# EasyEDA Pro project ProDoc_PCB1_2024-06-28.epro

# Board PCB1
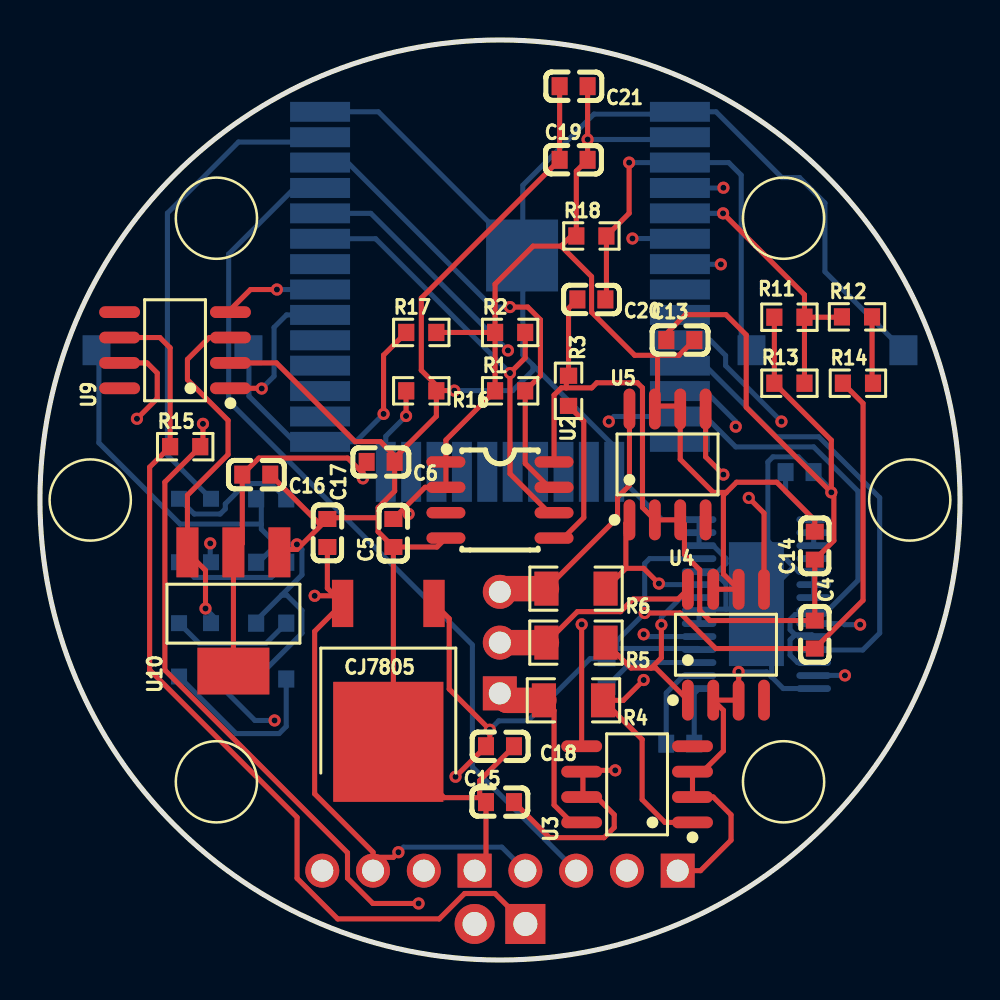
[diagram p0: board, top side]
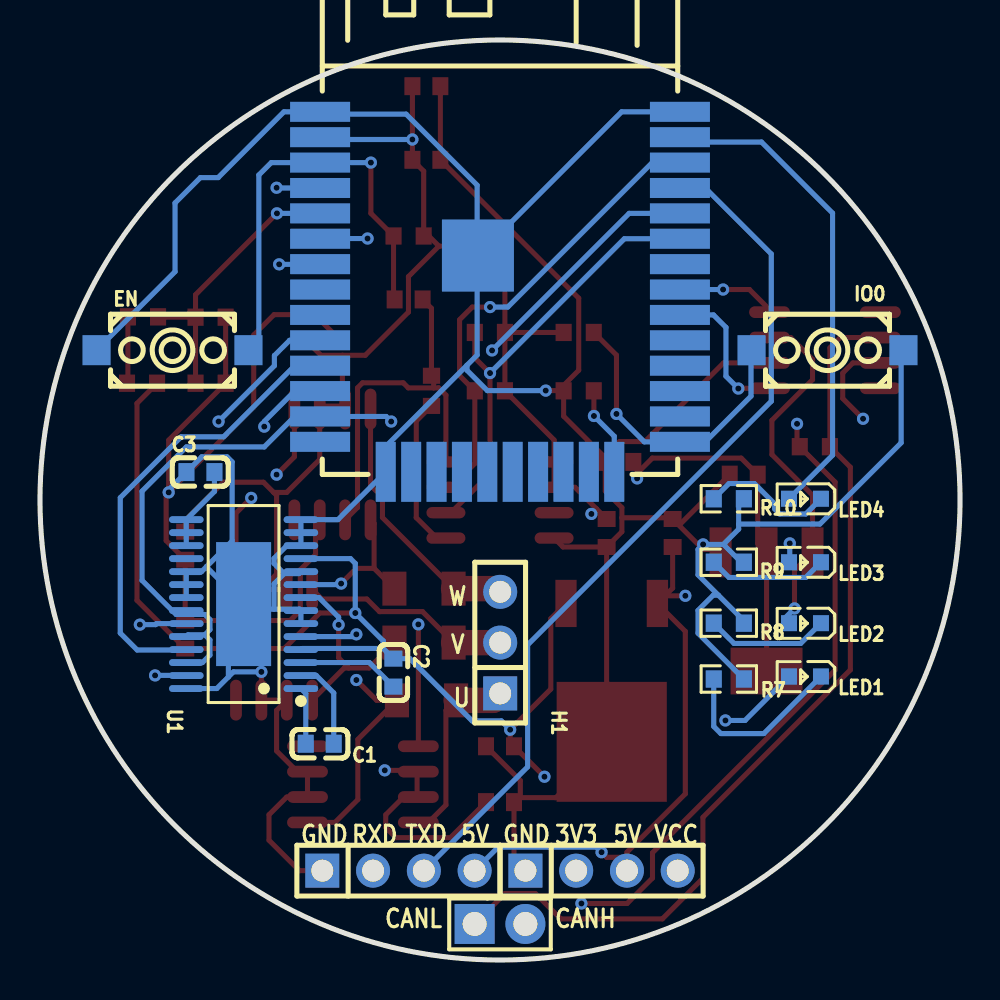
[diagram p1: board, bottom side, seen from below]

Outline 46.02 x 46.02 mm; copper layers: Top Layer, Inner1, Inner2, Bottom Layer. Coordinates in mm from the lower left corner of the outline.
Outline path: circle c23.01,23.01 r23.01
Stack: Top Layer 0.035mm 外层铜厚1oz / Dielectric1 0.2104mm 7628 RC49% 8.6mil / Inner1 0.0152mm 内层铜厚 / Dielectric2 1.065mm 1.1mm H/HOZ Copper / Inner2 0.0152mm 内层铜厚 / Dielectric3 0.2104mm 7628 RC49% 8.6mil / Bottom Layer 0.035mm 外层铜厚1oz

## Design rules (mm)
template: JLCPCB Capability(Two Layers Board)
spacing copperThickness1oz (default): track to track 0.102, other pairs 0.152 to 0.3
spacing copperThickness2oz: track to track 0.203, other pairs 0.152 to 0.3
track width copperThickness1oz (default): min 0.127, default 0.254, max 2.54
track width copperThickness2oz: min 0.203, default 0.254, max 2.54
differential pair differentialPair (default): width min 0.127, default 0.254, max 2.54; gap min 0.152, default 0.152
via viaSize (default): diameter min 0.5, default 0.61, max 10; hole min 0.3, default 0.305, max 6.3

## Placement (name value [footprint] x y rotation side)
C1  10nF  [C0603]  32.03 10.82 0 bottom
C2  0.1uF  [C0603]  28.35 14.38 270 bottom
C3  470nF  [C0603]  38 24.41 180 bottom
C4  0.1uF  [C0603]  38.76 16.28 270 top
C5  0.1uF  [C0603]  17.68 21.36 90 top
C6  1uF  [C0603]  17.04 24.92 180 top
C13  100nF  [C0603]  32.03 31.01 0 top
C14  100nF  [C0603]  38.76 20.73 90 top
C15  100nF  [C0603]  23.01 7.9 0 top
C16  100nF  [C0603]  10.82 24.28 180 top
C17  1uF  [C0603]  14.38 21.36 270 top
C18  1uF  [C0603]  23.01 10.69 180 top
C19  100nF  [C0603]  26.7 40.03 0 top
C20  100nF  [C0603]  27.58 33.05 180 top
C21  1uF  [C0603]  26.7 43.71 180 top
CJ7805  CJ7805 3%  [TO-252-2_L6.6-W6.1-P4.58-LS10.1-BR-CW]  17.42 14.38 90 top
EN  K2-1107ST-A4DW-06  [KEY-SMD_L6.2-W3.6-LS8.0]  39.4 30.51 180 bottom
H1  PZ254V-11-03P  [HDR-TH_3P-P2.54-V-M]  23 15.88 90 bottom
H2  PZ254V-11-04P  [HDR-TH_4P-P2.54-V-M]  17.93 4.47 180 bottom
H3  PZ254V-11-04P  [HDR-TH_4P-P2.54-V-M]  28.09 4.47 180 bottom
H4  PZ254V-11-02P  [HDR-TH_2P-P2.54-V-M]  23.01 1.8 180 bottom
IO0  K2-1107ST-A4DW-06  [KEY-SMD_L6.2-W3.6-LS8.0]  6.63 30.51 0 bottom
LED1  KT-0603R  [LED0603-RD]  7.76 14.18 0 bottom
LED2  KT-0603R  [LED0603-RD]  7.76 16.85 0 bottom
LED3  KT-0603R  [LED0603-RD]  7.76 19.9 0 bottom
LED4  KT-0603R  [LED0603-RD]  7.76 23.07 0 bottom
R1  10kΩ  [R0603]  23.52 28.47 0 top
R2  10kΩ  [R0603]  23.52 31.39 0 top
R3  1kΩ  [R0603]  26.44 28.47 270 top
R4  10mΩ  [R1206]  26.69 12.99 180 top
R5  10mΩ  [R1206]  26.81 15.88 180 top
R6  10mΩ  [R1206]  26.82 18.58 180 top
R7  1kΩ  [R0603]  11.57 14.06 0 bottom
R8  1kΩ  [R0603]  11.57 16.85 0 bottom
R9  1kΩ  [R0603]  11.57 19.9 0 bottom
R10  1kΩ  [R0603]  11.57 23.07 0 bottom
R11  1kΩ  [R0603]  37.49 32.16 0 top
R12  10kΩ  [R0603]  40.87 32.17 0 top
R13  1kΩ  [R0603]  37.49 28.85 0 top
R14  10kΩ  [R0603]  40.92 28.85 0 top
R15  120Ω  [R0603]  7.26 25.68 0 top
R16  1kΩ  [R0603]  19.08 28.47 180 top
R17  10kΩ  [R0603]  19.08 31.39 0 top
R18  10kΩ  [R0603]  27.58 36.22 0 top
U1  DRV8313PWPR  [HTSSOP-28_L9.8-W4.5-P0.65-LS6.6-BL-EP]  35.84 17.81 90 bottom
U2  AS5600-ASOM  [SOIC-8_L5.0-W4.0-P1.27-LS6.0-BL]  23.01 23.01 270 top
U3  INA240A2DR  [SOIC-8_L4.9-W3.9-P1.27-LS6.0-BL]  29.87 8.79 90 top
U4  INA240A2DR  [SOIC-8_L4.9-W3.9-P1.27-LS6.0-BL]  34.32 15.77 0 top
U5  INA240A2DR  [SOIC-8_L4.9-W3.9-P1.27-LS6.0-BL]  31.39 24.79 0 top
U6  2.4GHz  [WIRELM-SMD_ESP32-S]  23.01 33.43 180 bottom
U9  TJA1051T/3/1J  [SOIC-8_L4.9-W3.9-P1.27-LS6.0-BL]  6.76 30.51 90 top
U10  AMS1117-3.3  [SOT-223-3_L6.5-W3.4-P2.30-LS7.0-BR]  9.68 17.42 90 top

## Footprints (pads in the part's own frame, mm; a bottom-side part is the same pattern mirrored in y, then rotated)
C0603
  rect 0.8x0.9 smd: 1(-0.7,0) 2(0.7,0)
HDR-TH_2P-P2.54-V-M
  rect 2x2 hole 1.2: 1(-1.27,0)
  round 2 hole 1.2: 2(1.27,0)
HDR-TH_3P-P2.54-V-M
  rect 1.7x1.7 hole 1.1: 1(-2.54,0)
  round 1.7 hole 1.1: 2(0,0) 3(2.54,0)
HDR-TH_4P-P2.54-V-M
  rect 1.7x1.7 hole 1.1: 1(-3.81,0)
  round 1.7 hole 1.1: 2(-1.27,0) 3(1.27,0) 4(3.81,0)
HTSSOP-28_L9.8-W4.5-P0.65-LS6.6-BL-EP
  oval 0.343x1.732 smd: 1(-4.225,-2.866) 2(-3.575,-2.866) 3(-2.925,-2.866) 4(-2.275,-2.866) 5(-1.625,-2.866) 6(-0.975,-2.866) 7(-0.325,-2.866) 8(0.325,-2.866) 9(0.975,-2.866) 10(1.625,-2.866) 11(2.275,-2.866) 12(2.925,-2.866) 13(3.575,-2.866) 14(4.225,-2.866) 15(4.225,2.866) 16(3.575,2.866) 17(2.925,2.866) 18(2.275,2.866) 19(1.625,2.866) 20(0.975,2.866) 21(0.325,2.866) 22(-0.325,2.866) 23(-0.975,2.866) 24(-1.625,2.866) 25(-2.275,2.866) 26(-2.925,2.866) 27(-3.575,2.866) 28(-4.225,2.866)
  rect 6.2x2.75 smd: 29(0,0)
KEY-SMD_L6.2-W3.6-LS8.0
  rect 1.4x1.5 smd: 1(-3.8,0) 2(3.8,0)
LED0603-RD
  rect 0.8x0.8 smd: 1(-0.799,0) 2(0.799,0)
R0603
  rect 0.806x0.864 smd: 1(-0.753,0) 2(0.753,0)
R1206
  rect 1.208x1.701 smd: 1(-1.479,0) 2(1.479,0)
SOIC-8_L4.9-W3.9-P1.27-LS6.0-BL
  oval 0.588x2.045 smd: 1(-1.905,-2.772) 2(-0.635,-2.772) 3(0.635,-2.772) 4(1.905,-2.772) 5(1.905,2.772) 6(0.635,2.772) 7(-0.635,2.772) 8(-1.905,2.772)
SOIC-8_L5.0-W4.0-P1.27-LS6.0-BL
  oval 0.569x1.95 smd: 1(-1.905,-2.705) 2(-0.635,-2.705) 3(0.635,-2.705) 4(1.905,-2.705) 5(1.905,2.705) 6(0.635,2.705) 7(-0.635,2.705) 8(-1.905,2.705)
SOT-223-3_L6.5-W3.4-P2.30-LS7.0-BR
  rect 2.5x1.1 smd: 1(2.97,-2.3) 2(2.97,0) 3(2.97,2.3)
  rect 2.34x3.6 smd: 4(-2.97,0)
TO-252-2_L6.6-W6.1-P4.58-LS10.1-BR-CW
  rect 2.364x1.064 smd: 1(3.462,-2.286) 3(3.462,2.286)
  rect 6.004x5.512 smd: 2(-3.462,0)
WIRELM-SMD_ESP32-S
  rect 3x1 smd: 1(-9,9.005) 2(-9,7.735) 3(-9,6.465) 4(-9,5.195) 5(-9,3.925) 6(-9,2.655) 7(-9,1.385) 8(-9,0.115) 9(-9,-1.155) 10(-9,-2.425) 11(-9,-3.695) 12(-9,-4.965) 13(-9,-6.235) 14(-9,-7.505) 25(9,-7.505) 26(9,-6.235) 27(9,-4.965) 28(9,-3.695) 29(9,-2.425) 30(9,-1.155) 31(9,0.115) 32(9,1.385) 33(9,2.655) 34(9,3.925) 35(9,5.195) 36(9,6.465) 37(9,7.735) 38(9,9.005)
  rect 1x3 smd: 15(-5.715,-9.005) 16(-4.445,-9.005) 17(-3.175,-9.005) 18(-1.905,-9.005) 19(-0.635,-9.005) 20(0.635,-9.005) 21(1.905,-9.005) 22(3.175,-9.005) 23(4.445,-9.005) 24(5.715,-9.005)
  rect 3.6x3.6 smd: 39(-1.105,1.815)

## Nets
3V3: C5.2 C6.2 C13.2 C14.2 C15.2 C16.2 C19.2 C21.1 H2.2 R1.1 R2.1 R17.2 R18.1 U2.1 U2.2 U3.6 U3.7 U4.6 U4.7 U5.6 U5.7 U6.2 U10.2 U10.4
+5V: C17.2 CJ7805.3 H2.3 H3.4 LED2.2 U9.3 U10.3
GND: C3.1 C4.1 C5.1 C6.1 C13.1 C14.1 C15.1 C16.1 C17.1 C18.1 C19.1 C20.2 C21.2 CJ7805.2 EN.1 H2.1 H3.1 IO0.1 R3.1 R7.1 R8.1 R9.1 R10.1 R11.1 R13.1 R16.1 U1.6 U1.7 U1.10 U1.12 U1.13 U1.14 U1.19 U1.20 U1.21 U1.28 U1.29 U2.4 U2.8 U3.2 U3.3 U4.2 U4.3 U5.2 U5.3 U6.1 U6.15 U6.38 U6.39 U9.2 U10.1
VCC: C2.1 C4.2 C18.2 CJ7805.1 H2.4 LED1.2 R14.1 U1.4 U1.11
VCC_ADC: R11.2 R12.1 R13.2 U6.5
CAN_RXD: U6.31 U9.4
CAN_TXD: U6.30 U9.1
CANH: H4.2 R15.2 U9.7
CANL: H4.1 R15.1 U9.6
EN: LED3.2 U1.22 U1.24 U1.26 U6.13
ESP_RXD: H3.2 U6.34
ESP_TXD: H3.3 U6.35
I_U: U3.5 U6.6
I_V: U4.5 U6.7
I_W: U5.5 U6.4
IO-LED: LED4.2 U6.37
OUT_U: R4.1 U1.5 U3.1
OUT_V: R5.1 U1.8 U4.1
OUT_W: R6.1 U1.9 U5.1
PWM_U: U1.27 U6.10
PWM_V: U1.25 U6.11
PWM_W: U1.23 U6.12
SCL: R1.2 U2.7 U6.36
SDA: R2.2 U2.6 U6.33
U: H1.1 R4.2 U3.8
V: H1.2 R5.2 U4.8
W: H1.3 R6.2 U5.8
$1N347: C3.2 U1.15 U1.16 U1.17
$1N350: C1.2 U1.1
$1N351: C1.1 U1.2
$1N352: C2.2 U1.3
$1N750: R3.2 U2.5
$1N6376: LED1.1 R7.2
$1N6414: LED2.1 R8.2
$1N9932: R12.2 R14.2
$1N9943: IO0.2 R17.1 U6.25
$1N9983: R16.2 U6.24
$1N10250: C20.1 EN.2 R18.2 U6.3
$1N11040: LED3.1 R9.2
$1N11082: LED4.1 R10.2

Pads without a net: U1 18; U2 3; U3 4; U4 4; U5 4; U6 8 9 14 16 17 18 19 20 21 22 23 26 27 28 29 32; U9 5 8

## Via types
v1: diameter 0.61, hole 0.305, Top Layer to Bottom Layer, 43 vias

## Routing (per net, layer and track width the routed paths; a pad name or vN(x,y) marks a point on that pad's centre or on a via; arc(x,y) is an arc through that point)
3V3: length 128.3
  Top Layer w0.254: 27.16,9.36 U3.6 ; 27.16,9.36 27.33,9.36 27.46,9.49 v1(28.78,9.49) ; 27.16,9.36 27.16,8.15 ; 27.4,43.71 v1(27.4,41.05) 27.4,40.03 26.83,39.47 R18.1 26.58,36.22 26.07,35.71 ; 18.19,22.57 v1(18.44,22.32) ; 18.19,22.57 C5.2 ; 18.19,22.57 19.26,23.65 U2.2 U2.1 20.31,26.01 R1.1 R2.1 ; U10.4 U10.2 10.12,20.84 C16.2 10.95,25.11 15.39,25.11 16.15,24.35 ; 30.89,30.25 30.89,27.71 ; 30.89,30.25 29.75,30.25 27.59,32.41 27.59,34.19 26.07,35.71 ; 30.89,30.25 31.97,30.25 C13.2 ; 30.89,27.71 31.88,27.71 U5.6 32.03,25.04 33.68,23.39 34.34,23.39 ; 30.89,27.71 30.89,27.7 U5.7 ; 27.16,8.15 U3.7 ; 27.16,8.15 27.84,8.15 28.73,7.26 28.73,6.63 28.22,6.12 25.49,6.12 C15.2 ; 26.07,35.71 24.66,35.71 22.77,33.82 R2.1 ; U4.7 U4.6 34.19,19.31 34.19,23.24 34.34,23.39 ; R2.1 R17.2 ; C14.2 38.76,22 36.86,23.9 34.84,23.9 34.34,23.39 ; 16.15,24.35 16.15,24.73 C6.2 ; 16.15,24.35 v1(16.15,24.09)
  Inner1 w0.254: v1(28.78,9.49) 28.78,10.64 27.08,12.34 ; 27.08,12.34 H2.2 ; 27.08,12.34 27.08,13.43 23.27,17.24 22.5,17.24 18.44,21.3 v1(18.44,22.32) 17.93,22.32 v1(16.15,24.09)
  Bottom Layer w0.254: v1(27.4,41.05) 31.9,41.05 U6.2
+5V: length 51.4
  Top Layer w0.254: 14.76,18.22 CJ7805.3 13.74,16.44 13.74,8.31 16.66,5.39 16.66,5.14 ; 14.76,18.22 14.38,18.6 C17.2 ; 14.76,18.22 v1(13.74,18.22) ; 16.66,5.14 H2.3 ; 16.66,5.14 17.68,5.14 v1(17.93,5.39) ; 9.4,31.14 8.47,31.14 7.38,30.05 7.38,29.03 9.41,27 9.41,25.28 7.38,23.25 U10.3 8.28,19.49 v1(8.28,17.58)
  Inner1 w0.254: v1(8.28,17.58) 13.11,17.58 v1(13.74,18.22)
  Bottom Layer w0.254: v1(8.28,17.58) 8.79,17.08 LED2.2 ; v1(17.93,5.39) 18.19,5.65 23.11,5.65 H3.4
GND: length 283.6
  Top Layer w0.254: 22,8.12 22.09,8.12 C15.1 22.31,5.04 H2.1 ; 22,8.12 22,8.98 C18.1 ; 22,8.12 20.22,8.12 CJ7805.2 17.68,11.17 C5.1 ; U10.1 12.12,20.54 12.85,20.54 ; 26.33,28.62 26.08,28.62 25.72,28.26 U2.8 ; 26.33,28.62 26.33,29.12 R3.1 26.44,32.6 C20.2 ; 26.33,28.62 27.6,28.62 27.85,28.88 29.89,28.88 30.14,28.62 30.14,22.64 U5.2 U5.3 32.24,21.81 32.24,20.28 33,19.52 33,17.49 33.51,16.98 38.76,16.98 C14.1 39.71,20.98 39.71,23.27 v1(39.59,23.39) ; 17.8,25.17 17.03,25.93 15.76,25.93 11.83,29.87 9.4,29.87 ; 17.8,25.17 17.8,24.97 C6.1 17.74,23.46 16.92,22.63 16.92,22.12 ; 17.8,25.17 19.83,27.2 R16.1 19.84,28.49 20.09,28.49 ; v1(39.59,23.39) 39.59,26 R13.1 R11.1 ; v1(39.59,23.39) 35.33,27.65 35.33,31.27 34.32,32.28 32.28,32.28 31.33,31.33 C13.1 ; v1(20.73,28.49) 20.09,28.49 ; 20.09,28.49 19.08,29.5 19.08,33.11 C19.1 C21.2 ; C5.1 19.86,20.66 U2.4 ; C5.1 16.92,21.42 16.92,22.12 ; v1(34.95,14.41) U4.3 U4.2 34.19,12.49 34.19,10.46 33.15,9.42 U3.3 U3.2 33.68,8.15 34.57,7.26 34.57,5.99 33.05,4.47 H3.1 ; 14.12,21.81 C17.1 14.44,22.12 16.92,22.12 ; 14.12,21.81 14,21.81 C16.1 ; 14.12,21.81 12.85,20.54 ; 12.85,20.54 v1(12.85,20.79)
  Bottom Layer w0.254: 34.32,17.55 33.04,17.55 U1.7 U1.6 ; 34.32,17.55 34.32,18.82 33.81,19.33 ; 34.32,17.55 35.59,17.55 ; 11.84,20.79 10.94,19.9 R9.1 ; 11.84,20.79 11.07,21.55 11.07,21.81 ; 11.84,20.79 v1(12.85,20.79) 13.11,20.54 13.11,19.27 12.09,18.25 ; v1(34.95,14.41) 36.35,14.41 36.6,14.16 ; 36.6,14.16 37.18,13.58 U1.28 ; 36.6,14.16 36.6,15.27 35.59,16.28 35.59,17.55 ; 11.07,21.81 11.07,22.81 R10.1 ; 11.07,21.81 7.01,21.81 2.95,25.87 2.95,30.39 IO0.1 ; 24.66,29.76 24.16,30.26 24.16,35.2 ; 24.66,29.76 24.66,29.5 23.65,28.49 v1(20.73,28.49) ; 24.66,29.76 28.73,25.69 U6.15 31.12,22.03 U1.14 U1.13 U1.12 33.68,20.73 34.32,20.09 34.32,19.84 33.81,19.33 ; 33.81,19.33 33.07,19.33 U1.10 ; 12.09,18.25 12.34,18.25 13.11,17.49 13.11,16.35 R7.1 ; 12.09,18.25 10.81,16.97 R8.1 ; v1(39.59,23.39) 39.59,23.52 C3.1 37.94,25.17 36.67,25.17 36.41,24.92 36.41,20.96 37.68,19.69 ; 43.19,30.51 39.27,34.43 39.27,37.87 38,39.14 37.11,39.14 33.82,42.43 U6.1 31.9,42.32 27.71,42.32 24.16,38.76 24.16,35.2 ; 37.68,19.69 37.94,19.43 U1.19 U1.20 U1.21 ; 37.68,19.69 37.68,19.65 U1.29 35.59,17.55 ; U6.38 16.93,42.43 U6.39 24.16,35.2
VCC: length 75.2
  Top Layer w0.254: v1(30.25,17.36) 32.03,17.36 33.81,15.58 C4.2 41.17,17.99 41.17,27.85 R14.1 ; v1(20.79,9.17) C18.2 22.5,10.89 v1(22.5,11.52) 20.47,13.55 20.47,17.08 CJ7805.1
  Inner1 w0.254: 16.22,5.61 16.22,7.5 v1(11.74,11.98) ; 16.22,5.61 15.27,5.61 H2.4 ; 16.22,5.61 17.23,5.61 v1(20.79,9.17)
  Bottom Layer w0.254: U1.4 32.92,15.58 28.85,15.58 ; 28.85,15.58 28.85,15.96 v1(30.25,17.36) 30.25,19.84 30.49,20.08 U1.11 ; 28.85,15.58 C2.1 27.52,15.08 24.41,11.96 22.95,11.96 v1(22.5,11.52) ; v1(11.74,11.98) 10.75,11.98 LED1.2
VCC_ADC: length 14.3
  Top Layer w0.254: R11.2 40.1,32.16 R12.1 ; R11.2 38.24,33.28 v1(34.17,37.35) ; R11.2 38.24,28.98 38.12,28.85
  Bottom Layer w0.254: v1(34.17,37.35) U6.5
CAN_RXD: length 5.1
  Top Layer w0.254: v1(11.85,33.54) 10.53,33.54 9.4,32.41
  Bottom Layer w0.254: U6.31 v1(11.85,33.54)
CAN_TXD: length 7.9
  Top Layer w0.254: v1(11.09,28.59) 11.08,28.6 9.05,28.6
  Bottom Layer w0.254: v1(11.09,28.59) 11.71,29.21 11.71,31.65 12.33,32.27 U6.30
CANH: length 42.8
  Top Layer w0.254: v1(18.94,2.83) 16.65,2.83 15.38,4.1 15.38,5.37 6.25,14.5 6.25,23.91 R15.2 8.15,25.81 v1(8.15,26.82) ; v1(4.85,27.08) 5.87,28.09 5.87,29.36 5.36,29.87 U9.7
  Inner1 w0.254: v1(4.85,27.08) 7.9,27.08 v1(8.15,26.82) ; H4.2 20.72,2.83 v1(18.94,2.83)
CANL: length 46.3
  Top Layer w0.254: 3.86,31.14 5.99,31.14 6.51,30.62 R15.1 5.49,24.65 5.49,14.51 12.86,7.14 12.86,4.09 14.89,2.06 19.97,2.06 21.24,3.33 22.76,3.33 H4.1
EN: length 52.1
  Inner2 w0.254: v1(28.46,26.94) 21.23,19.71 10.31,19.71 9.18,20.84 v1(8.52,20.84)
  Bottom Layer w0.254: LED3.2 8.52,19.94 v1(8.52,20.84) ; U1.26 37.9,14.88 37.52,15.25 37.52,16.02 37.78,16.27 ; 39.41,17.48 39.21,17.29 37.78,17.29 37.52,17.03 37.52,16.52 37.78,16.27 ; 39.41,17.48 U1.22 ; 39.41,17.48 40.92,18.99 40.92,23.45 38.71,25.67 34.81,25.67 33.28,27.19 U6.13 28.71,27.19 v1(28.46,26.94) ; 37.78,16.27 38.62,16.27 U1.24
ESP_RXD: length 40.7
  Inner1 w0.254: v1(23.41,30.49) 29.36,24.54 H3.2
  Bottom Layer w0.254: U6.34 16.55,37.35 v1(23.41,30.49)
ESP_TXD: length 44
  Bottom Layer w0.254: H3.3 21.63,9.66 21.63,15.76 9.44,27.95 9.44,35.32 12.74,38.62 14.01,38.62
I_U: length 28.8
  Top Layer w0.254: U3.5 v1(27.1,16.79)
  Inner2 w0.254: v1(27.1,16.79) 29.64,19.33 v1(29.64,36.09)
  Bottom Layer w0.254: v1(29.64,36.09) 30.73,36.09 30.74,36.08 U6.6
I_V: length 19.2
  Top Layer w0.254: v1(35.46,23.12) 36.22,22.36 U4.5
  Inner1 w0.254: v1(35.46,23.12) 35.46,33.4 v1(34.06,34.8)
  Bottom Layer w0.254: U6.7 32.02,34.8 v1(34.06,34.8)
I_W: length 20.9
  Top Layer w0.254: v1(34.19,24.28) 33.3,25.17 U5.5
  Inner2 w0.254: v1(34.19,24.28) 34.19,32.66 35.08,33.55 35.08,37.74 v1(34.19,38.63)
  Bottom Layer w0.254: v1(34.19,38.63) 34.18,38.62 32.01,38.62
IO-LED: length 24.4
  Bottom Layer w0.254: LED4.2 6.38,25.25 6.38,37.36 9.93,40.92 13.77,40.92 U6.37
OUT_U: length 16.3
  Top Layer w0.254: v1(30.2,14.01) 29.18,12.99 R4.1 30.12,11.03 30.12,8.03 31.27,6.88 U3.1
  Inner2 w0.254: v1(30.2,14.01) v1(30.2,16.29)
  Bottom Layer w0.254: v1(30.2,16.29) 30.31,16.18 U1.5
OUT_V: length 10.4
  Top Layer w0.254: 30.58,14.61 29.56,14.61 R5.1 ; 30.58,14.61 31.09,15.12 v1(31.09,16.77) ; 30.58,14.61 30.8,14.61 U4.1
  Bottom Layer w0.254: U1.8 32.07,18.13 31.09,17.15 v1(31.09,16.77)
OUT_W: length 7.9
  Top Layer w0.254: v1(30.96,18.83) 30.2,19.59 29.31,19.59 ; 29.31,19.59 R6.1 ; 29.31,19.59 29.31,21.84 U5.1
  Bottom Layer w0.254: U1.9 31.01,18.78 v1(30.96,18.83)
PWM_U: length 22.6
  Inner1 w0.254: v1(37.09,26.94) 37.09,17.41 v1(40.27,14.24)
  Bottom Layer w0.254: v1(40.27,14.24) 38.71,14.24 U1.27 ; v1(37.09,26.94) 34.3,29.73 34.3,30.24 33.54,31 U6.10
PWM_V: length 23.2
  Bottom Layer w0.254: U6.11 33.28,29.73 36.84,26.18 38.96,26.18 42.01,23.13 42.01,16.35 41.16,15.51 38.73,15.51 U1.25
PWM_W: length 18.5
  Inner2 w0.254: v1(34.81,26.68) 34.81,26.08 41.03,19.85 v1(41.03,16.78)
  Bottom Layer w0.254: v1(34.81,26.68) 34.81,26.94 33.28,28.46 U6.12 ; U1.23 40.19,16.83 40.25,16.78 v1(41.03,16.78)
SCL: length 23.8
  Top Layer w0.254: U2.7 25.64,23.57 25.54,23.57 24.27,24.84 R1.2 25.04,29.24 25.04,32.03 24.4,32.66 v1(23.51,32.66)
  Bottom Layer w0.254: U6.36 14.02,39.9 15.38,39.9 22.62,32.66 v1(23.51,32.66)
SDA: length 22.7
  Top Layer w0.254: R2.2 24.27,30.12 v1(23.51,29.36) 23.51,24.33 25.46,22.38 U2.6
  Bottom Layer w0.254: U6.33 16.79,36.08 v1(23.51,29.36)
U: length 9.5
  Top Layer w0.254: U3.8 26.59,6.88 25.72,7.76 25.72,12.48 R4.2
  Top Layer w1.27: H1.1 23.35,12.99 R4.2
V: length 10.5
  Top Layer w0.254: R5.2 26.88,17.43 29.04,17.43 29.67,18.06 31.92,18.06 U4.8
  Top Layer w1.27: R5.2 H1.2
W: length 13.1
  Top Layer w0.254: U5.8 29.49,23.75 28.89,23.15 28.89,22.13 R6.2
  Top Layer w1.27: H1.3 23.16,18.58 R6.2
$1N347: length 4.3
  Bottom Layer w0.254: C3.2 37.3,23.44 U1.15 U1.16 U1.17
$1N350: length 2.9
  Bottom Layer w0.254: U1.1 32.73,13.34 C1.2
$1N351: length 4.5
  Bottom Layer w0.254: U1.2 32.2,14.23 31.33,13.36 C1.1
$1N352: length 5.1
  Bottom Layer w0.254: U1.3 29.55,14.88 C2.2
$1N750: length 7.8
  Top Layer w0.254: R3.2 27.2,26.96 27.2,22.13 26.18,21.11 U2.5
$1N6376: length 9.1
  Bottom Layer w0.254: LED1.1 9.81,11.33 11.96,11.33 12.32,11.68 R7.2
$1N6414: length 6.2
  Bottom Layer w0.254: R8.2 11.3,15.83 7.97,15.83 LED2.1
$1N9932: length 3.3
  Top Layer w0.254: R14.2 41.62,28.9 R12.2
$1N9943: length 15.1
  Top Layer w0.254: R17.1 17.19,30.26 v1(17.19,27.32)
  Bottom Layer w0.254: v1(17.19,27.32) 15.79,25.92 U6.25 12.74,25.92 10.46,28.21 10.46,30.48 IO0.2
$1N9983: length 4.5
  Top Layer w0.254: R16.2 18.31,28.46 v1(18.31,27.22)
  Bottom Layer w0.254: U6.24 17.3,26.2 v1(18.31,27.22)
$1N10250: length 22.2
  Top Layer w0.254: C20.1 28.34,33.1 R18.2 29.47,37.35 v1(29.47,39.89)
  Bottom Layer w0.254: v1(29.47,39.89) U6.3 34.45,39.89 35.08,39.27 35.08,31.02 EN.2
$1N11040: length 6
  Bottom Layer w0.254: R9.2 11.56,19.14 7.72,19.14 LED3.1
$1N11082: length 6.8
  Bottom Layer w0.254: R10.2 11.56,23.84 10.29,23.84 9.27,22.82 9.27,22.57 9.02,22.31 7.72,22.31 LED4.1

## Copper pours and planes (outline as drawn; the poured copper is in the pictures)
GND on Inner1: -6.07,34.32 -6.07,4.72 3.84,-5.18 46.25,-5.18 55.52,4.09 55.52,37.62 48.42,44.73 4.34,44.73

## Text on the board
Bottom Silkscreen Layer: 5V | 3V3 | CANH | TXD | CANL | RXD | GND | VCC | U | V | W
